# EAGLE schematic OLMv11 (EAGLE 6.5.0)
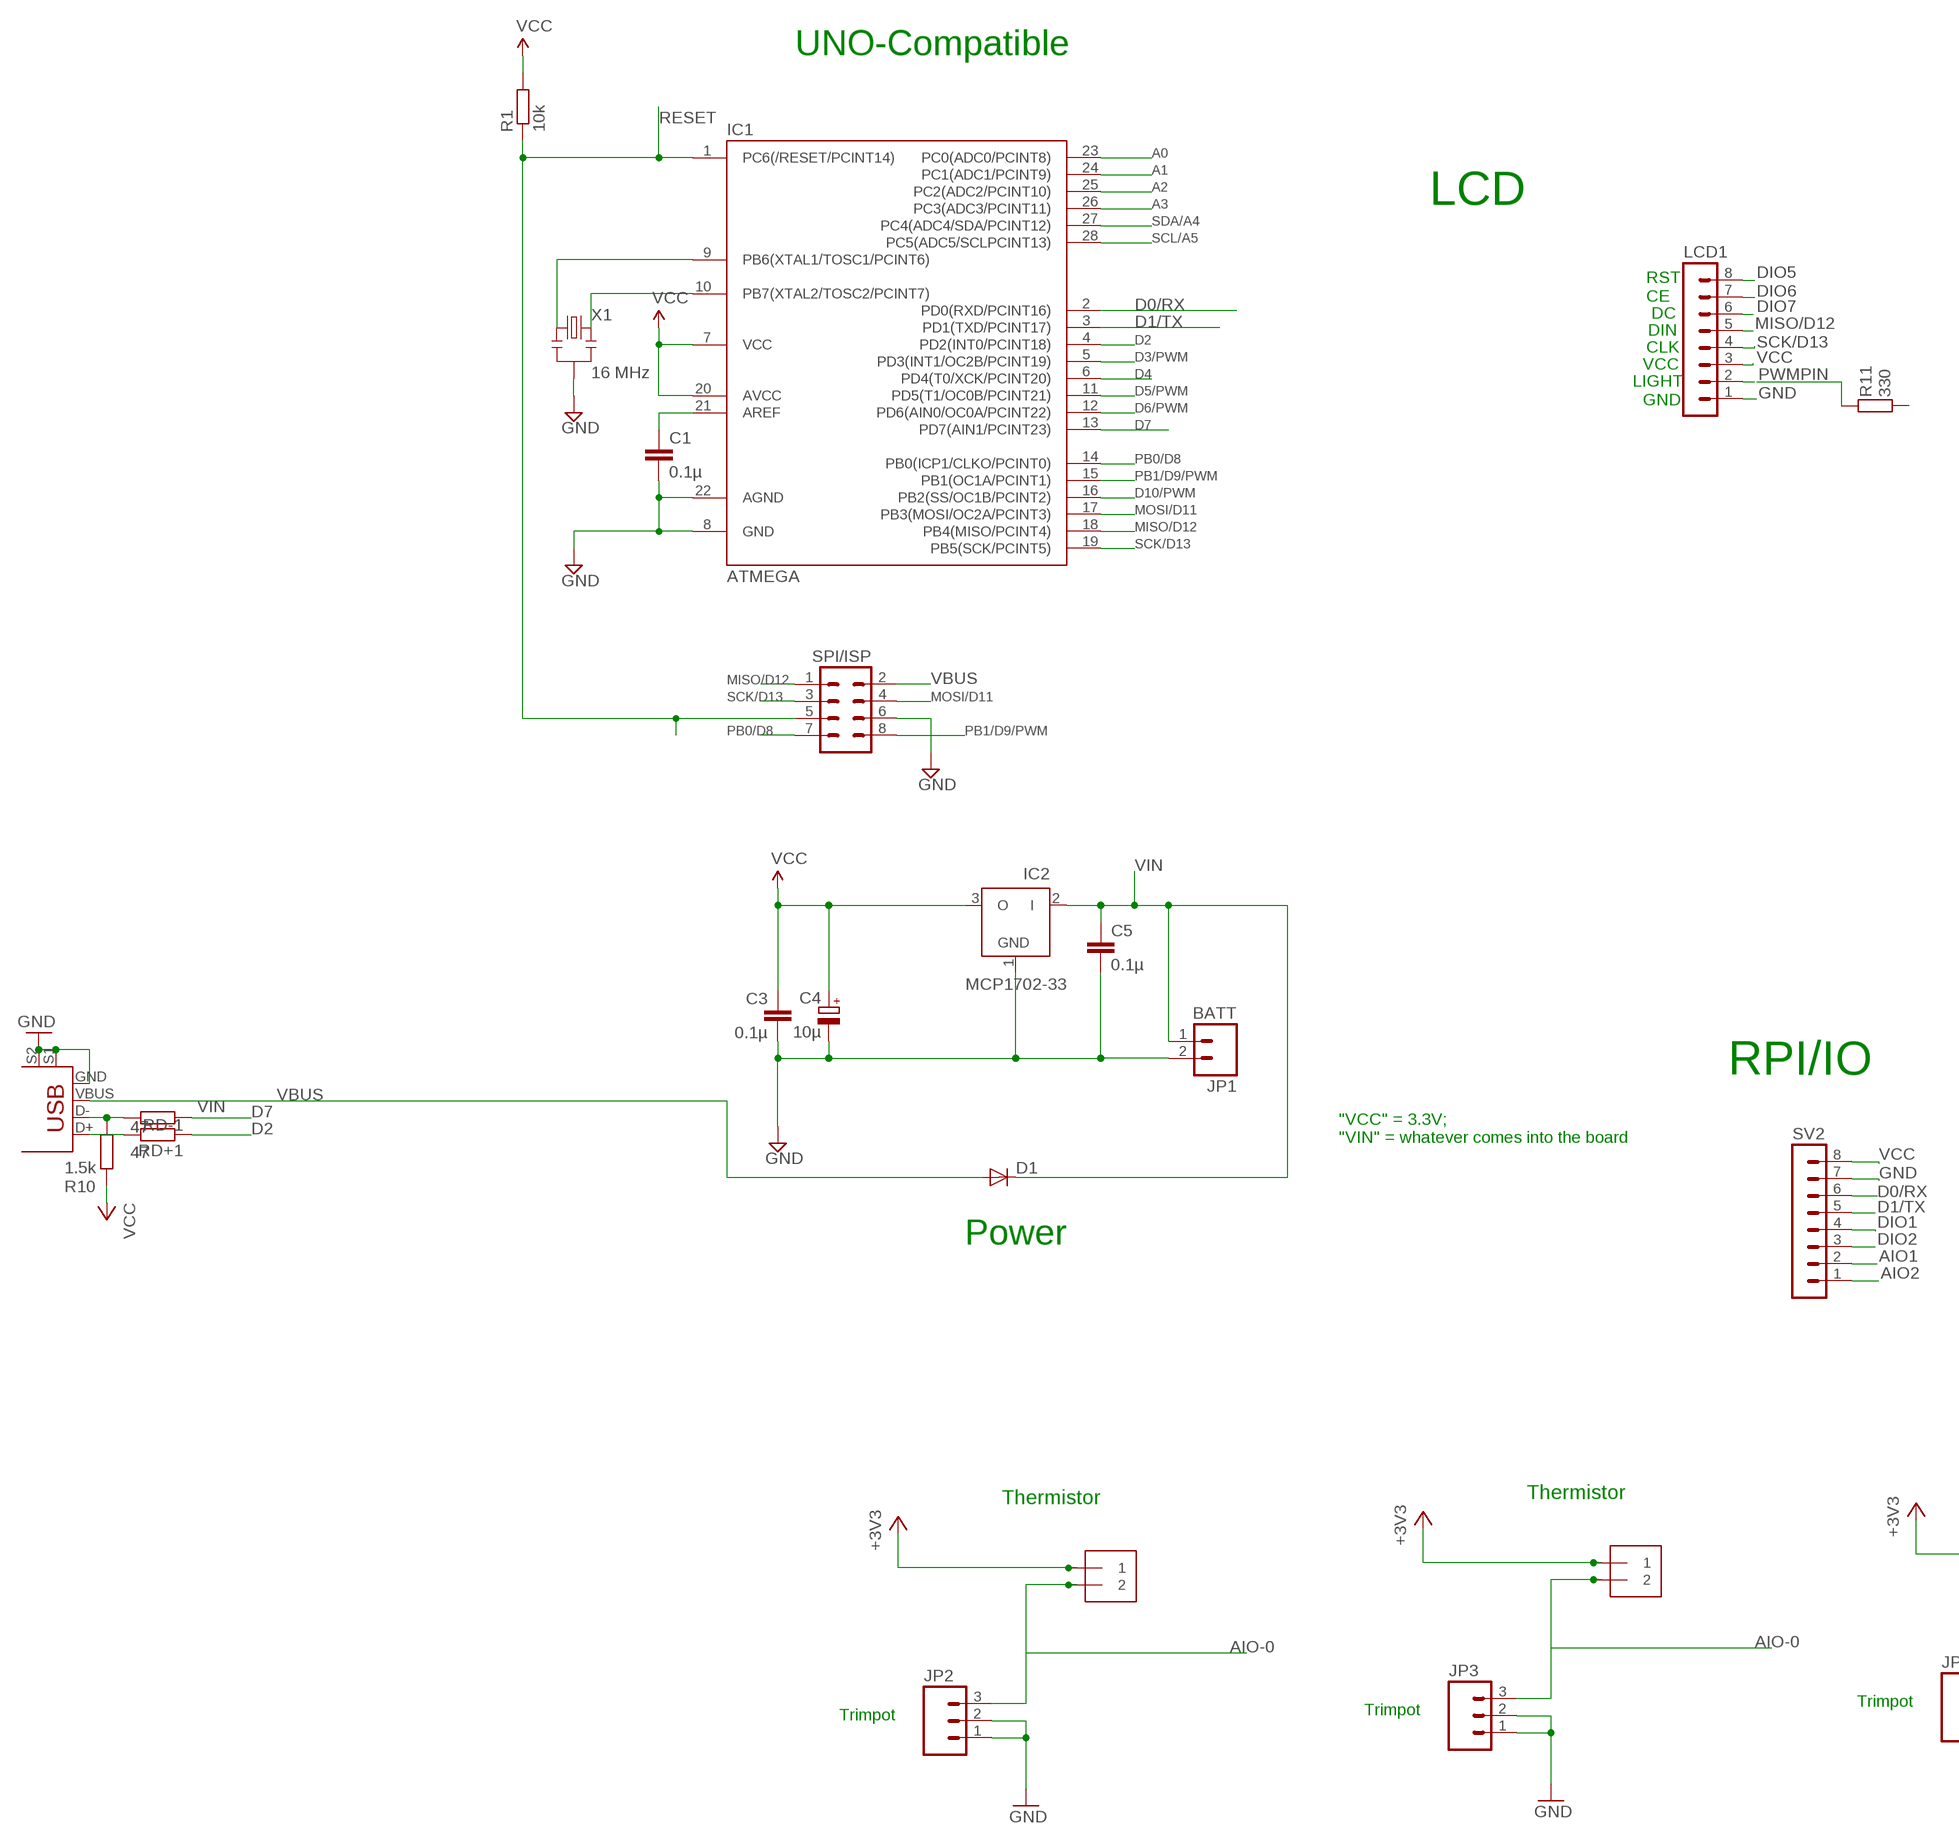
[diagram p0: schematic, sheet 1, part 1 of 2]
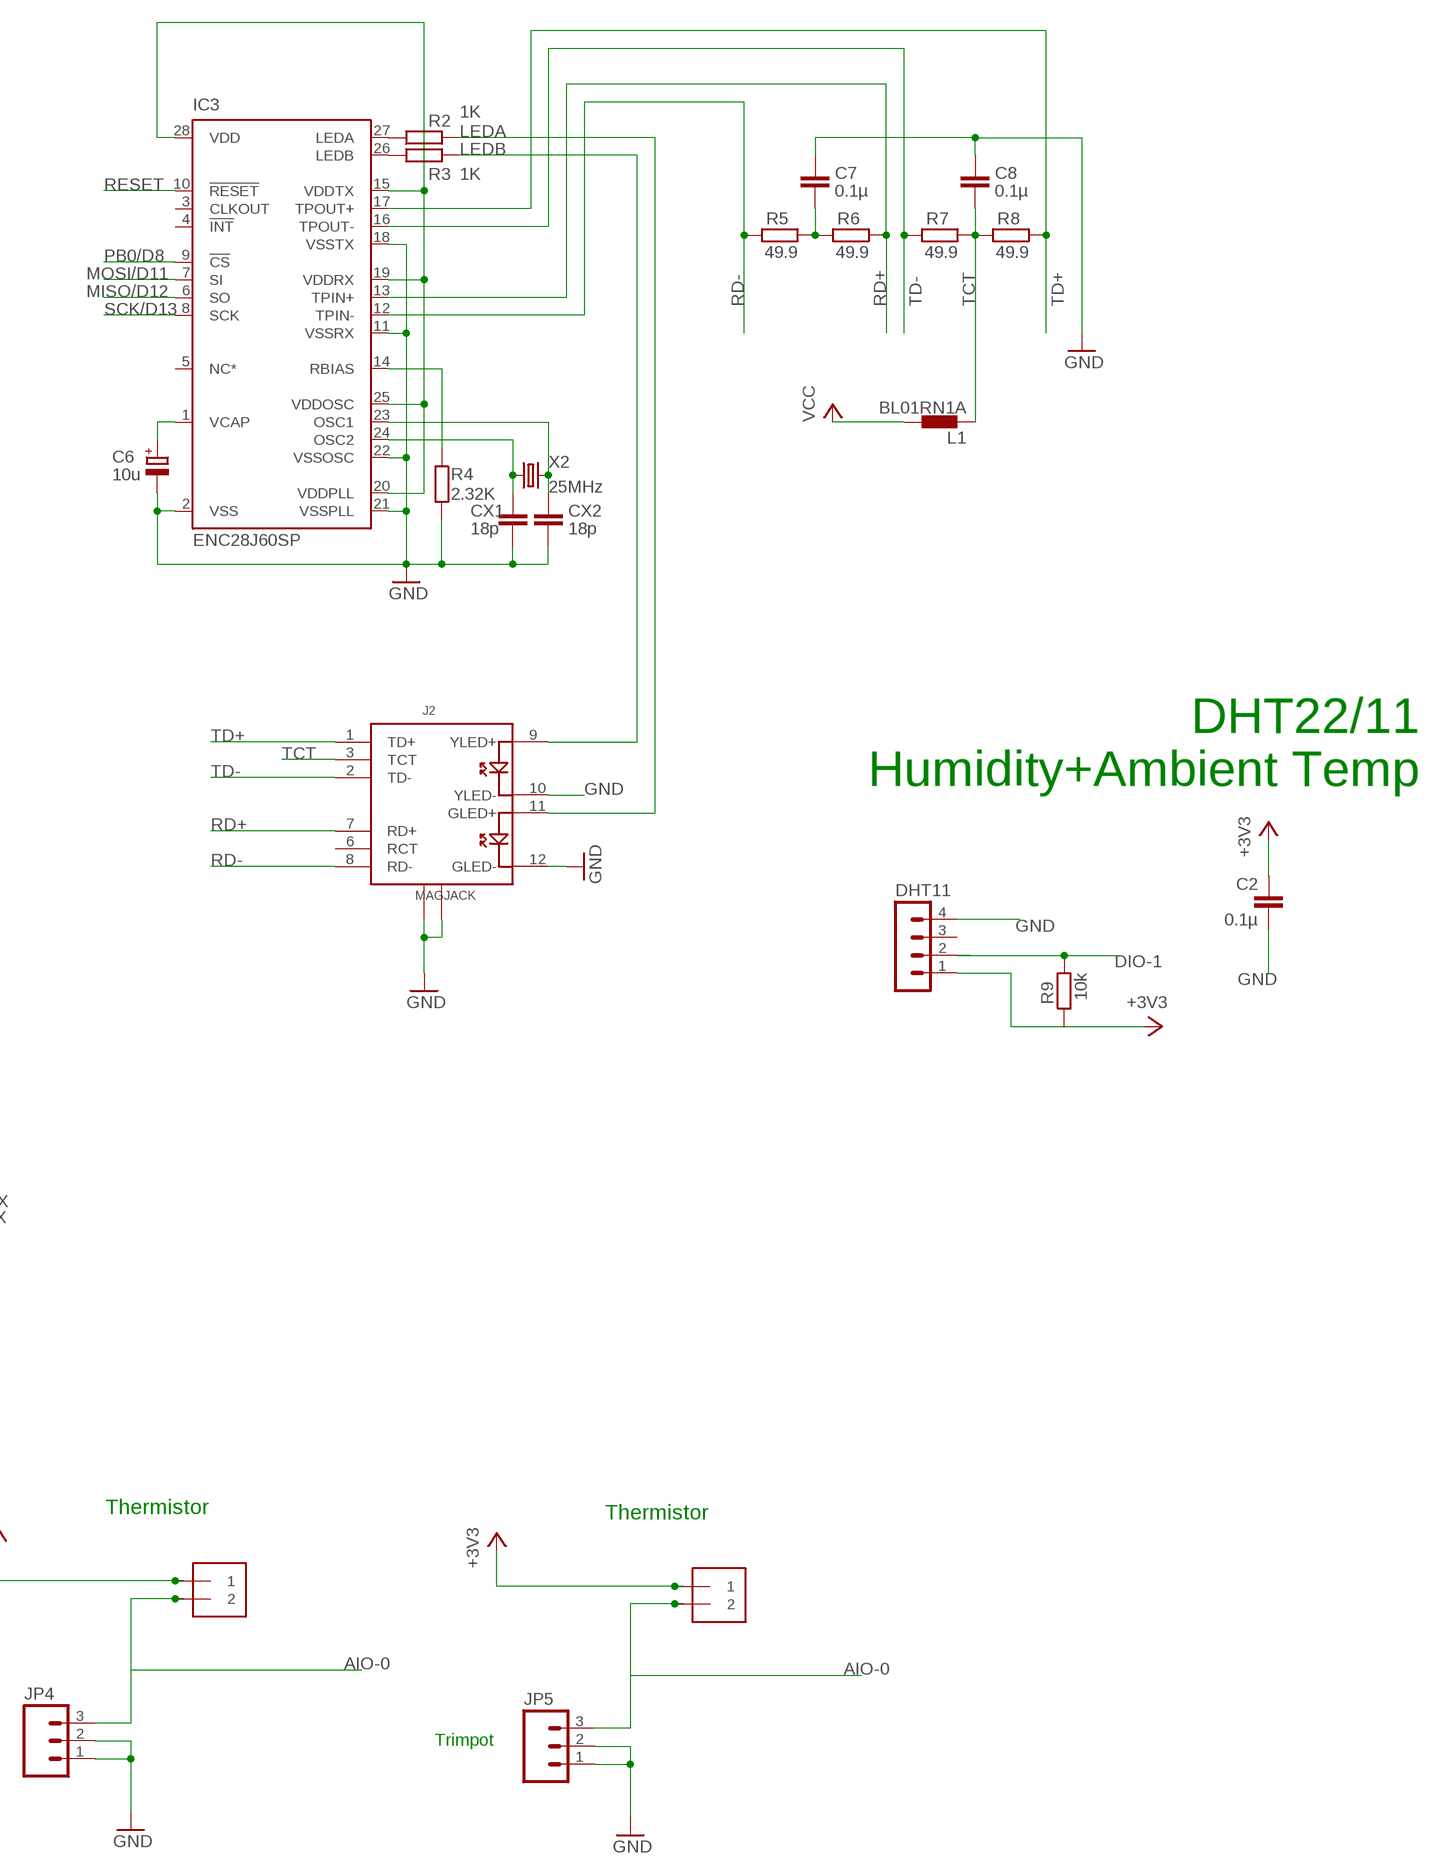
[diagram p1: schematic, sheet 1, part 2 of 2]

## Parts
C1  0.1µ  C-EU025-024X044  [C025-024X044]
C2  0.1µ  C-EU025-024X044  [C025-024X044]
C3  0.1µ  C-EU025-024X044  [C025-024X044]
C4  10µ  CPOL-EUE1.8-4  [E1,8-4]
C5  0.1µ  C-EU025-024X044  [C025-024X044]
C6  10u  CPOL-EUE1.8-4  [E1,8-4]
C7  0.1µ  C-EU025-024X044  [C025-024X044]
C8  0.1µ  C-EU025-024X044  [C025-024X044]
CX1  18p  C-EU025-024X044  [C025-024X044]
CX2  18p  C-EU025-024X044  [C025-024X044]
D1  DIODE-D-5  [D-5]
DHT11  MA04-1  [MA04-1]
IC1  ATMEGA  ATMEGA48/88/168-PU  [DIL28-3]
IC2  MCP1702-33  MCP1702Z  [TO92]
IC3  ENC28J60SP  [DIL28-3]
J1  1X2-3.5MM  [1X2-3.5MM]
J2  MAGJACK  [MAGJACK]
J3  1X2-3.5MM  [1X2-3.5MM]
J4  1X2-3.5MM  [1X2-3.5MM]
J5  1X2-3.5MM  [1X2-3.5MM]
JP1  BATT  M02LOCK_LONGPADS  [1X02_LOCK_LONGPADS]
JP2  M03PTH  [1X03]
JP3  M03PTH  [1X03]
JP4  M03PTH  [1X03]
JP5  M03PTH  [1X03]
L1  BL01RN1A  [BL01RN1A]
LCD1  MA08-1  [MA08-1]
R1  10k  R-EU_0204/7  [0204/7]
R2  1K  R-EU_0204/7  [0204/7]
R3  1K  R-EU_0204/7  [0204/7]
R4  2.32K  R-EU_0204/7  [0204/7]
R5  49.9  R-EU_0204/7  [0204/7]
R6  49.9  R-EU_0204/7  [0204/7]
R7  49.9  R-EU_0204/7  [0204/7]
R8  49.9  R-EU_0204/7  [0204/7]
R9  10k  R-EU_0204/7  [0204/7]
R10  1.5k  R-EU_0204/7  [0204/7]
R11  330  R-EU_0204/7  [0204/7]
RD+1  47  R-EU_0204/7  [0204/7]
RD-1  47  R-EU_0204/7  [0204/7]
SV1  SPI/ISP  MA04-2  [MA04-2]
SV2  MA08-1  [MA08-1]
USB  USB+SHIELD  [USB-B-PTH]
X1  16 MHz  RESONATORPTH  [RESONATOR-PTH]
X2  25MHz  CRYSTALHC49US  [HC49US]

## Nets
+3V3: C2.1 DHT11.1 J1.1 J3.1 J4.1 J5.1 R9.1
A0: IC1.23(PC0(ADC0/PCINT8))
A1: IC1.24(PC1(ADC1/PCINT9))
A2: IC1.25(PC2(ADC2/PCINT10))
A3: IC1.26(PC3(ADC3/PCINT11))
AIO1: SV2.2
AIO2: SV2.1
AIO-0: J1.2 J3.2 J4.2 J5.2 JP2.3 JP3.3 JP4.3 JP5.3
D0/RX: IC1.2(PD0(RXD/PCINT16)) SV2.6
D1/TX: IC1.3(PD1(TXD/PCINT17)) SV2.5
D2: IC1.4(PD2(INT0/PCINT18)) RD+1.1
D3/PWM: IC1.5(PD3(INT1/OC2B/PCINT19))
D4: IC1.6(PD4(T0/XCK/PCINT20))
D5/PWM: IC1.11(PD5(T1/OC0B/PCINT21))
D6/PWM: IC1.12(PD6(AIN0/OC0A/PCINT22))
D7: IC1.13(PD7(AIN1/PCINT23)) RD-1.1
D10/PWM: IC1.16(PB2(SS/OC1B/PCINT2))
DIO1: SV2.4
DIO2: SV2.3
DIO5 [power]: LCD1.8
DIO6: LCD1.7
DIO7 [power]: LCD1.6
DIO-1: DHT11.2 R9.2
GND [power]: C1.2 C2.2 C3.2 C4.- C5.2 C6.- C7.1 C8.1 CX1.2 CX2.2 DHT11.4 IC1.8(GND) IC1.22(AGND) IC2.1(GND) IC3.2(VSS) IC3.11(VSSRX) IC3.18(VSSTX) IC3.21(VSSPLL) IC3.22(VSSOSC) J2.10(YLED-) J2.12(GLED-) J2.M1(GND1) J2.M2(GND2) JP1.2 JP2.1 JP2.2 JP3.1 JP3.2 JP4.1 JP4.2 JP5.1 JP5.2 LCD1.1 R4.2 SV1.6 SV2.7 USB.GND USB.S1 USB.S2 X1.2
LEDA: J2.11(GLED+) R2.2
LEDB: J2.9(YLED+) R3.2
MISO/D12: IC1.18(PB4(MISO/PCINT4)) IC3.6(SO) LCD1.5 SV1.1
MOSI/D11: IC1.17(PB3(MOSI/OC2A/PCINT3)) IC3.7(SI) SV1.4
N$1: IC1.9(PB6(XTAL1/TOSC1/PCINT6)) X1.1
N$2: R11.1
N$19: C1.1 IC1.21(AREF)
N$21: IC1.10(PB7(XTAL2/TOSC2/PCINT7)) X1.3
N$37: IC3.27(LEDA) R2.1
N$38: RD+1.2 USB.D+
N$39: IC3.26(LEDB) R3.1
N$45: R10.1 RD-1.2 USB.D-
N$50: C6.+ IC3.1(VCAP)
N$51: IC3.14(RBIAS) R4.1
N$52: CX1.1 IC3.24(OSC2) X2.1
N$53: CX2.1 IC3.23(OSC1) X2.2
N$54: C7.2 R5.2 R6.1
PB0/D8: IC1.14(PB0(ICP1/CLKO/PCINT0)) IC3.9(!CS) SV1.7
PB1/D9/PWM: IC1.15(PB1(OC1A/PCINT1)) SV1.8
PWMPIN: LCD1.2
RD+: IC3.13(TPIN+) J2.7(RD+) R6.2
RD-: IC3.12(TPIN-) J2.8(RD-) R5.1
RESET: IC1.1(PC6(/RESET/PCINT14)) IC3.10(!RESET) R1.1 SV1.5
SCK/D13: IC1.19(PB5(SCK/PCINT5)) IC3.8(SCK) LCD1.4 SV1.3
SCL/A5: IC1.28(PC5(ADC5/SCLPCINT13))
SDA/A4: IC1.27(PC4(ADC4/SDA/PCINT12))
TCT: C8.2 J2.3(TCT) L1.1 R7.2 R8.1
TD+: IC3.17(TPOUT+) J2.1(TD+) R8.2
TD-: IC3.16(TPOUT-) J2.2(TD-) R7.1
VBUS: D1.A SV1.2
VCC [power]: C3.1 C4.+ IC1.7(VCC) IC1.20(AVCC) IC2.3(O) IC3.15(VDDTX) IC3.19(VDDRX) IC3.20(VDDPLL) IC3.25(VDDOSC) IC3.28(VDD) L1.2 LCD1.3 R1.2 R10.2 SV2.8
VIN: C5.1 D1.C IC2.2(I) JP1.1 USB.VBUS
Unconnected: DHT11.3 IC3.3(CLKOUT) IC3.4(!INT) IC3.5(NC*) J2.6(RCT) R11.2

## Notes on the sheet
- UNO-Compatible
- LCD
- RST
- CE
- DC
- DIN
- CLK
- VCC
- LIGHT
- GND
- DHT22/11
  Humidity+Ambient Temp
- RPI/IO
- "VCC" = 3.3V;
  "VIN" = whatever comes into the board
- Power
- Thermistor | Thermistor
- Thermistor | Thermistor
- Trimpot
- Trimpot | Trimpot
- Trimpot

## Library data of the parts
C1-C3 C5 C7 C8 CX1 CX2 = resistor:C-EU: CAPACITOR, European symbol
C4 C6 = resistor:CPOL-EU: POLARIZED CAPACITOR, European symbol
D1 = diode:DIODE-: DIODE
DHT11 = con-lstb:MA04-1: PIN HEADER; OC_FARNELL: unknown; OC_NEWARK: unknown
IC1 = atmega8:ATMEGA48/88/168-PU
IC2 = JeeLabs:MCP1702: 200 mA, Low Power Low Dropout Voltage Regulator
IC3 = microchip:ENC28J60: Stand-Alone Ethernet Controller with SPI Interface Source: http://ww1.microchip.com/downloads/en/DeviceDoc/39662c.pdf; MF: MICROCHIP; MPN: ENC28J60/SP; OC_FARNELL: 1084619; OC_NEWARK: 96K3661
J1 J3-J5 = adafruit:1X2: 3.5mm Terminal block http://www.ladyada.net/library/pcb/eaglelibrary.html
J2 = SparkFun:MAGJACK
JP1 = SparkFun:M02: Header 2 Standard 2-pin 0.1" header. Use with straight break away headers (SKU : PRT-00116), right angle break away headers (PRT-00553), swiss pins (PRT-00743), machine pins (PRT-00117), and female headers (PRT-00115). Molex polarized connector foot print use with SKU : PRT-08233 with associated crimp pins and housings.
JP2-JP5 = SparkFun-Connectors:M03: Header 3 Standard 3-pin 0.1" header. Use with straight break away headers (SKU : PRT-00116), right angle break away headers (PRT-00553), swiss pins (PRT-00743), machine pins (PRT-00117), and female headers (PRT-00115). Molex polarized connector foot print use with SKU : PRT-08232 with associated crimp pins and housings.
L1 = inductors:BL0: Noise Suppression Products/EMI Suppression Filters, Lead EMIFIL(R) Inductor Type Source: http://www.murata.com .. BL01RN1_DS.pdf
LCD1 SV2 = con-lstb:MA08-1: PIN HEADER; OC_FARNELL: unknown; OC_NEWARK: unknown
R1 = resistor:R-EU_: RESISTOR, European symbol
R2-R11 RD+1 RD-1 = rcl:R-EU_: RESISTOR, European symbol
SV1 = JeeLabs:MA04-2: PIN HEADER
USB = SparkFunNew:USB+SHIELD: USB+Shield USB connector with shield pins connectable
X1 = SparkFun:RESONATOR: Resonator Small SMD resonator. This is the itty bitty 10/20MHz resonators with built in caps. CSTCE10M0G55 and CSTCE20M0V53. Footprint has been reviewed closely but hasn't been tested yet.
X2 = SparkFun:CRYSTAL: Crystals Various standard crystals. Proven footprints. Spark Fun Electronics SKU : COM-00534

## Net classes
0 default: width 0.406 mm, clearance 0.203 mm
1 power: width 0.813 mm, clearance 0.203 mm
2 gnd: width 0.305 mm, drill 0.559 mm, clearance 0.254 mm